# Altium project iot_pitmaster_pcb.PrjPcb
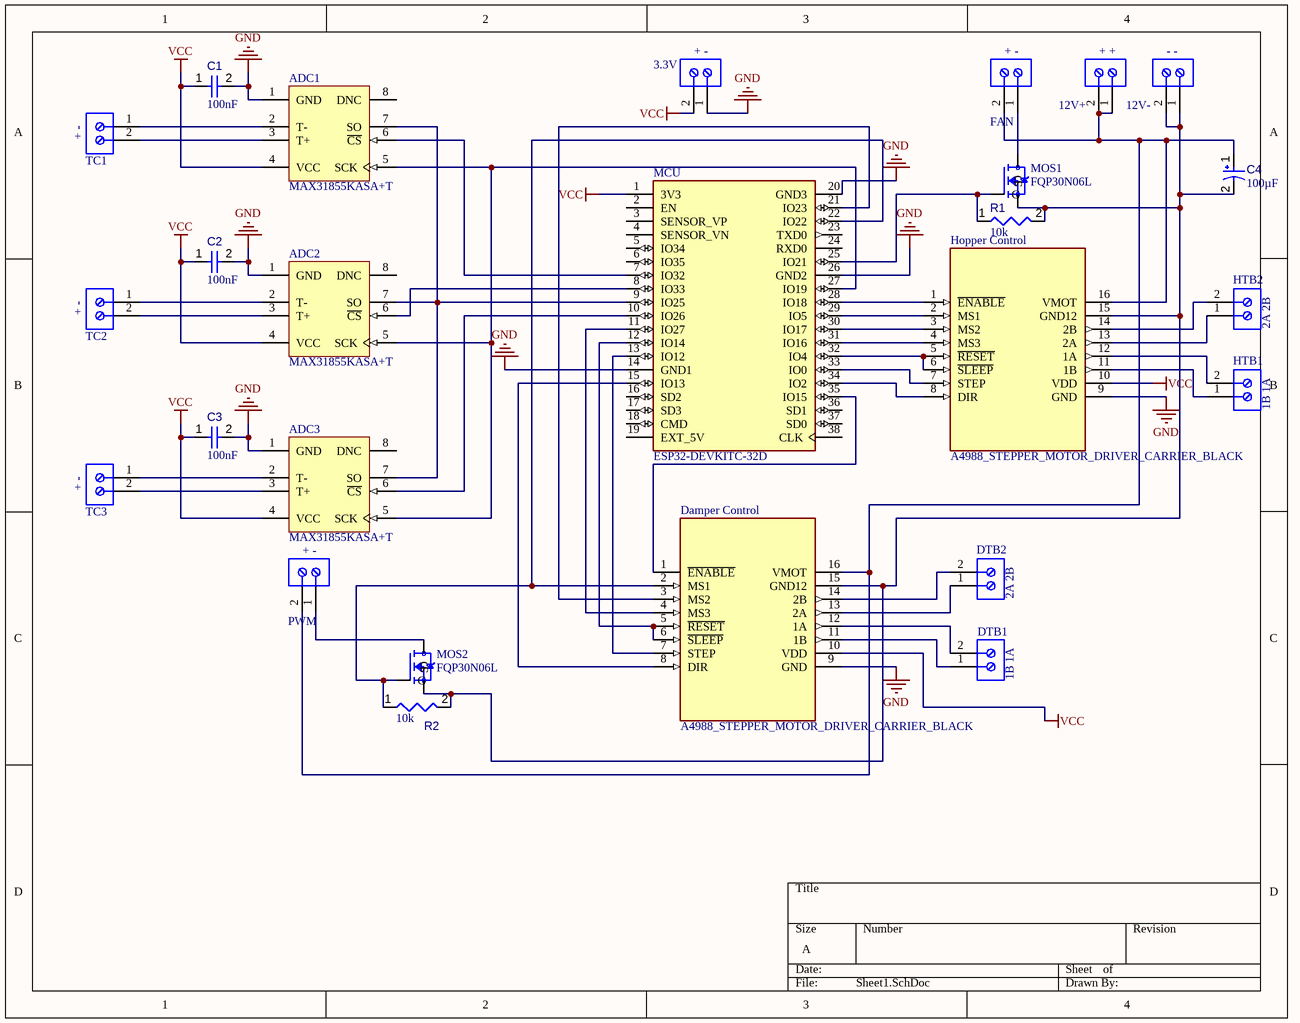
[diagram p0: Sheet1.SchDoc]
1 sheet, 26 parts. Net scope: global (net labels, ports and power ports of the same name join across sheets).
Board file: PCB1.PcbDoc

## Sheet Sheet1.SchDoc
size A

### Parts
3.3V  + -  [691103110002]
12V+  + +  [691103110002]
12V-  - -  [691103110002]
ADC1  MAX31855KASA+T  [MAXM-S8+4_N]
ADC2  MAX31855KASA+T  [MAXM-S8+4_N]
ADC3  MAX31855KASA+T  [MAXM-S8+4_N]
C1  value 100nF  [CAPC2013X95X50LL10T25]  (hidden comment: Capacitor 100 nF +/-10% 50 V 0805)
C2  value 100nF  [CAPC2013X95X50LL10T25]  (hidden comment: Capacitor 100 nF +/-10% 50 V 0805)
C3  value 100nF  [CAPC2013X95X50LL10T25]  (hidden comment: Capacitor 100 nF +/-10% 50 V 0805)
C4  value 100µF  [CAPPR65-350-1150X800X1250]  (hidden comment: ECA1HM101)
Damper_Control  A4988_STEPPER_MOTOR_DRIVER_CARRIER_BLACK  [MODULE_A4988_STEPPER_MOTOR_DRIVER_CARRIER_BLACK]
DTB1  1B 1A  [691103110002]
DTB2  2A 2B  [691103110002]
FAN  + -  [691103110002]
Hopper_Control  A4988_STEPPER_MOTOR_DRIVER_CARRIER_BLACK  [MODULE_A4988_STEPPER_MOTOR_DRIVER_CARRIER_BLACK]
HTB1  1B 1A  [691103110002]
HTB2  2A 2B  [691103110002]
MCU  ESP32-DEVKITC-32D  [MODULE_ESP32-DEVKITC-32D]
MOS1  FQP30N06L  [TO220V]
MOS2  FQP30N06L  [TO220V]
PWM  + -  [691103110002]
R1  value 10k  [RESC2013X50X35ML15T15]  (hidden comment: Resistor 10k +/-1% 0805 125 mW)
R2  value 10k  [RESC2013X50X35ML15T15]  (hidden comment: Resistor 10k +/-1% 0805 125 mW)
TC1  + -  [691103110002]
TC2  + -  [691103110002]
TC3  + -  [691103110002]

### Nets
GND: 3.3V.1 ADC1.1(GND) ADC2.1(GND) ADC3.1(GND) C1.2 C2.2 C3.2 Damper_Control.9(GND) Hopper_Control.9(GND) MCU.14(GND1) MCU.20(GND3) MCU.26(GND2)
VCC: 3.3V.2 ADC1.4(VCC) ADC2.4(VCC) ADC3.4(VCC) C1.1 C2.1 C3.1 Damper_Control.10(VDD) Hopper_Control.10(VDD) MCU.1(3V3)
Net12V+_1: 12V+.1 12V+.2 C4.1 Damper_Control.16(VMOT) FAN.2 Hopper_Control.16(VMOT) PWM.2
Net12V-_1: 12V-.1 12V-.2 C4.2 Damper_Control.15(GND12) Hopper_Control.15(GND12) MOS1.3(S) MOS2.3(S) R1.2 R2.2
NetADC1_2: ADC1.2(T-) TC1.1
NetADC1_3: ADC1.3(T+) TC1.2
NetADC1_5: ADC1.5(SCK) ADC2.5(SCK) ADC3.5(SCK) MCU.27(IO19)
NetADC1_6: ADC1.6(~{CS}) MCU.7(IO32)
NetADC1_7: ADC1.7(SO) ADC2.7(SO) ADC3.7(SO) MCU.9(IO25)
NetADC2_2: ADC2.2(T-) TC2.1
NetADC2_3: ADC2.3(T+) TC2.2
NetADC2_6: ADC2.6(~{CS}) MCU.8(IO33)
NetADC3_2: ADC3.2(T-) TC3.1
NetADC3_3: ADC3.3(T+) TC3.2
NetADC3_6: ADC3.6(~{CS}) MCU.10(IO26)
NetDamper_Control_1: Damper_Control.1(~{ENABLE}) MCU.35(IO15)
NetDamper_Control_2: Damper_Control.2(MS1) MCU.22(IO22) MOS2.1(G) R2.1
NetDamper_Control_3: Damper_Control.3(MS2) MCU.21(IO23)
NetDamper_Control_4: Damper_Control.4(MS3) MCU.11(IO27)
NetDamper_Control_5: Damper_Control.5(~{RESET}) Damper_Control.6(~{SLEEP}) MCU.12(IO14)
NetDamper_Control_7: Damper_Control.7(STEP) MCU.13(IO12)
NetDamper_Control_8: Damper_Control.8(DIR) MCU.15(IO13)
NetDamper_Control_11: Damper_Control.11(1B) DTB1.1
NetDamper_Control_12: Damper_Control.12(1A) DTB1.2
NetDamper_Control_13: Damper_Control.13(2A) DTB2.1
NetDamper_Control_14: Damper_Control.14(2B) DTB2.2
NetFAN_1: FAN.1 MOS1.2(D)
NetHopper_Control_1: Hopper_Control.1(~{ENABLE}) MCU.28(IO18)
NetHopper_Control_2: Hopper_Control.2(MS1) MCU.29(IO5)
NetHopper_Control_3: Hopper_Control.3(MS2) MCU.30(IO17)
NetHopper_Control_4: Hopper_Control.4(MS3) MCU.31(IO16)
NetHopper_Control_5: Hopper_Control.5(~{RESET}) Hopper_Control.6(~{SLEEP}) MCU.32(IO4)
NetHopper_Control_7: Hopper_Control.7(STEP) MCU.33(IO0)
NetHopper_Control_8: Hopper_Control.8(DIR) MCU.34(IO2)
NetHopper_Control_11: Hopper_Control.11(1B) HTB1.1
NetHopper_Control_12: Hopper_Control.12(1A) HTB1.2
NetHopper_Control_13: Hopper_Control.13(2A) HTB2.1
NetHopper_Control_14: Hopper_Control.14(2B) HTB2.2
NetMCU_25: MCU.25(IO21) MOS1.1(G) R1.1
NetMOS2_2: MOS2.2(D) PWM.1

Not connected (* = marked no-connect by the designer): ADC1 8(DNC); ADC2 8(DNC); ADC3 8(DNC); MCU 2(EN) 3(SENSOR_VP) 4(SENSOR_VN) 5(IO34) 6(IO35) 16(SD2) 17(SD3) 18(CMD) 19(EXT_5V) 23(TXD0) 24(RXD0) 36(SD1) 37(SD0) 38(CLK)

### Library data of the parts
3.3V 12V+ 12V- DTB1 DTB2 FAN HTB1 HTB2 PWM TC1-TC3 = CMP-1502-03254-1: Series 1031 - 3.50 mm Horizontal Entry Modular with Pressure Clamp WR-TBL, 2 pin; Manufacturer: Wurth Elektronik; Pin Number: 2; Pitch: 3.50mm; Datasheet URL: http://katalog.we-online.de/em/datasheet/6911031100xx.pdf; Package Reference: 691103110002; Publisher: WurthElektronik; Manufacturer URL: http://www.we-online.de; Mounting Technology: THT; Operating Temperature: -40to105degC; Part Number: 691103110002; Packaging: Box
ADC1-ADC3 = MAX31855KASA+T: Cold Junction Compensated Thermocouple to Digital Converter, 14 Bits Temperature Resolution, -40 to 125 degC, 8-Pin SOIC (S8+4), Pb-Free, Tape ang Reel; Functions: Thermocouple-to-Digital Converter; Interface: SPI; Parasite Pwr.: No; DatasheetVersion: Rev. 2; PackageVersion: Rev. D, 10/2012; PackageReference: S8+4; PackageDescription: 8-Pin Small-Outline IC, Narrow, Body 3.9 x 4.9 mm, Pitch 1.27 mm; Supplier 1: Digi-Key; Supplier Part Number 1: MAX31855KASA+TTR-ND; Supplier 2: Digi-Key; Supplier Part Number 2: MAX31855KASA+TCT-ND; Supplier 3: Digi-Key; Supplier Part Number 3: MAX31855KASA+TDKR-ND; Supplier 4: Mouser; Supplier Part Number 4: 700-MAX31855KASA+T; Packing: Tape ang Reel; Generic Part Number: MAX31855; Mounting Technology: Surface Mount; Code_JEDEC: MS-012; PartNumber: MAX31855KASA+T; ComponentLink1Description: Manufacturer URL; ComponentLink1URL: http://www.maximintegrated.com/; ComponentLink2Description: Datasheet; ComponentLink2URL: http://datasheets.maximintegrated.com/en/ds/MAX31855.pdf; ComponentLink3Description: Package Specification; ComponentLink3URL: http://pdfserv.maximintegrated.com/package_dwgs/21-0041.PDF
C1-C3 = CMP-001-00018-6: Chip Capacitor, 100 nF, +/- 10%, 50 V, 0805 (2012 Metric); Capacitor Type: Ceramic; Voltage Rating: 50V; Pins: 2; Max Operating Temperature: 125°C; Min Operating Temperature: -55°C; Mounting Technology: SM; Case/Package: 0805; RoHS Compliant: True; Tolerance: 10%
C4 = CMP-001-00026-7: Aluminum Electrolytic Capacitor, 100 uF, +/- 20%, 50 V, -40 to 85 degC, 2-Pin THD, RoHS, Bulk; Manufacturer: Panasonic; Voltage Rating: 50V; Ripple Current: 250mA; Datasheet URL: https://industrial.panasonic.com/cdbs/www-data/pdf/RDF0000/ABA0000C1218.pdf; Lead Pitch: 3.5mm; Mounting Technology: TH; Package Description: 2-Pin Radial Lead, Dia 8 mm, Height 12.5 mm; Diameter: 8mm; Ripple Current (AC): 250mA; Manufacturer URL: http://www.panasonic.com/; Capacitor Type: Electrolytic; Max Operating Temperature: 85°C; Pins: 2; Min Operating Temperature: -40°C; Tolerance: 20%; Case/Package: Radial; Packaging: Bulk; Package Quantity: 200; Package Reference: CAPPR65-350-1150X800X1250; RoHS Compliant: True; Datasheet Version: Rev. 05, 10/2016
Damper_Control Hopper_Control = A4988_STEPPER_MOTOR_DRIVER_CARRIER_BLACK: Stepper motor controler; IC: A4988; 1A; Uin mot: 8Ã·35V; MF: {'manufacturer': u'Pololu'}; Availability: Unavailable; MP: A4988_STEPPER_MOTOR_DRIVER_CARRIER_BLACK; Value: *; Package: None; Price: None
MCU = ESP32-DEVKITC-32D: Eval Board For Esp-Wroom-32; MF: {'manufacturer': u'Espressif Systems'}; Availability: Unavailable; MP: ESP32-DEVKITC-32D; Value: *; Package: None; Price: None
MOS1 MOS2 = FQP30N06L: <b>N-Channel QFETÂ® MOSFET</b> <p>Source: <a href https://www.fairchildsemi.com/datasheets/FQ/FQP30N06L.pdf>Data Sheet </href>; MF: {'manufacturer': u'ON Semiconductor'}; Price: None; MP: FQP30N06L; Value: *; Availability: Unavailable; Package: None
R1 R2 = CMP-009-00018-5: Chip Resistor, 10 KOhm, +/- 1%, 125 mW, -55 to 155 degC, 0805 (2012 Metric); Power: 125mW; Voltage Rating: 150V; Tolerance: 1%; Pins: 2; Min Operating Temperature: -55°C; Case/Package: 0805; Max Operating Temperature: 155°C; RoHS Compliant: True; Mounting Technology: SM